# Altium schematic sheet Page13 SOM Interface.SchDoc
size 386 x 246 mm
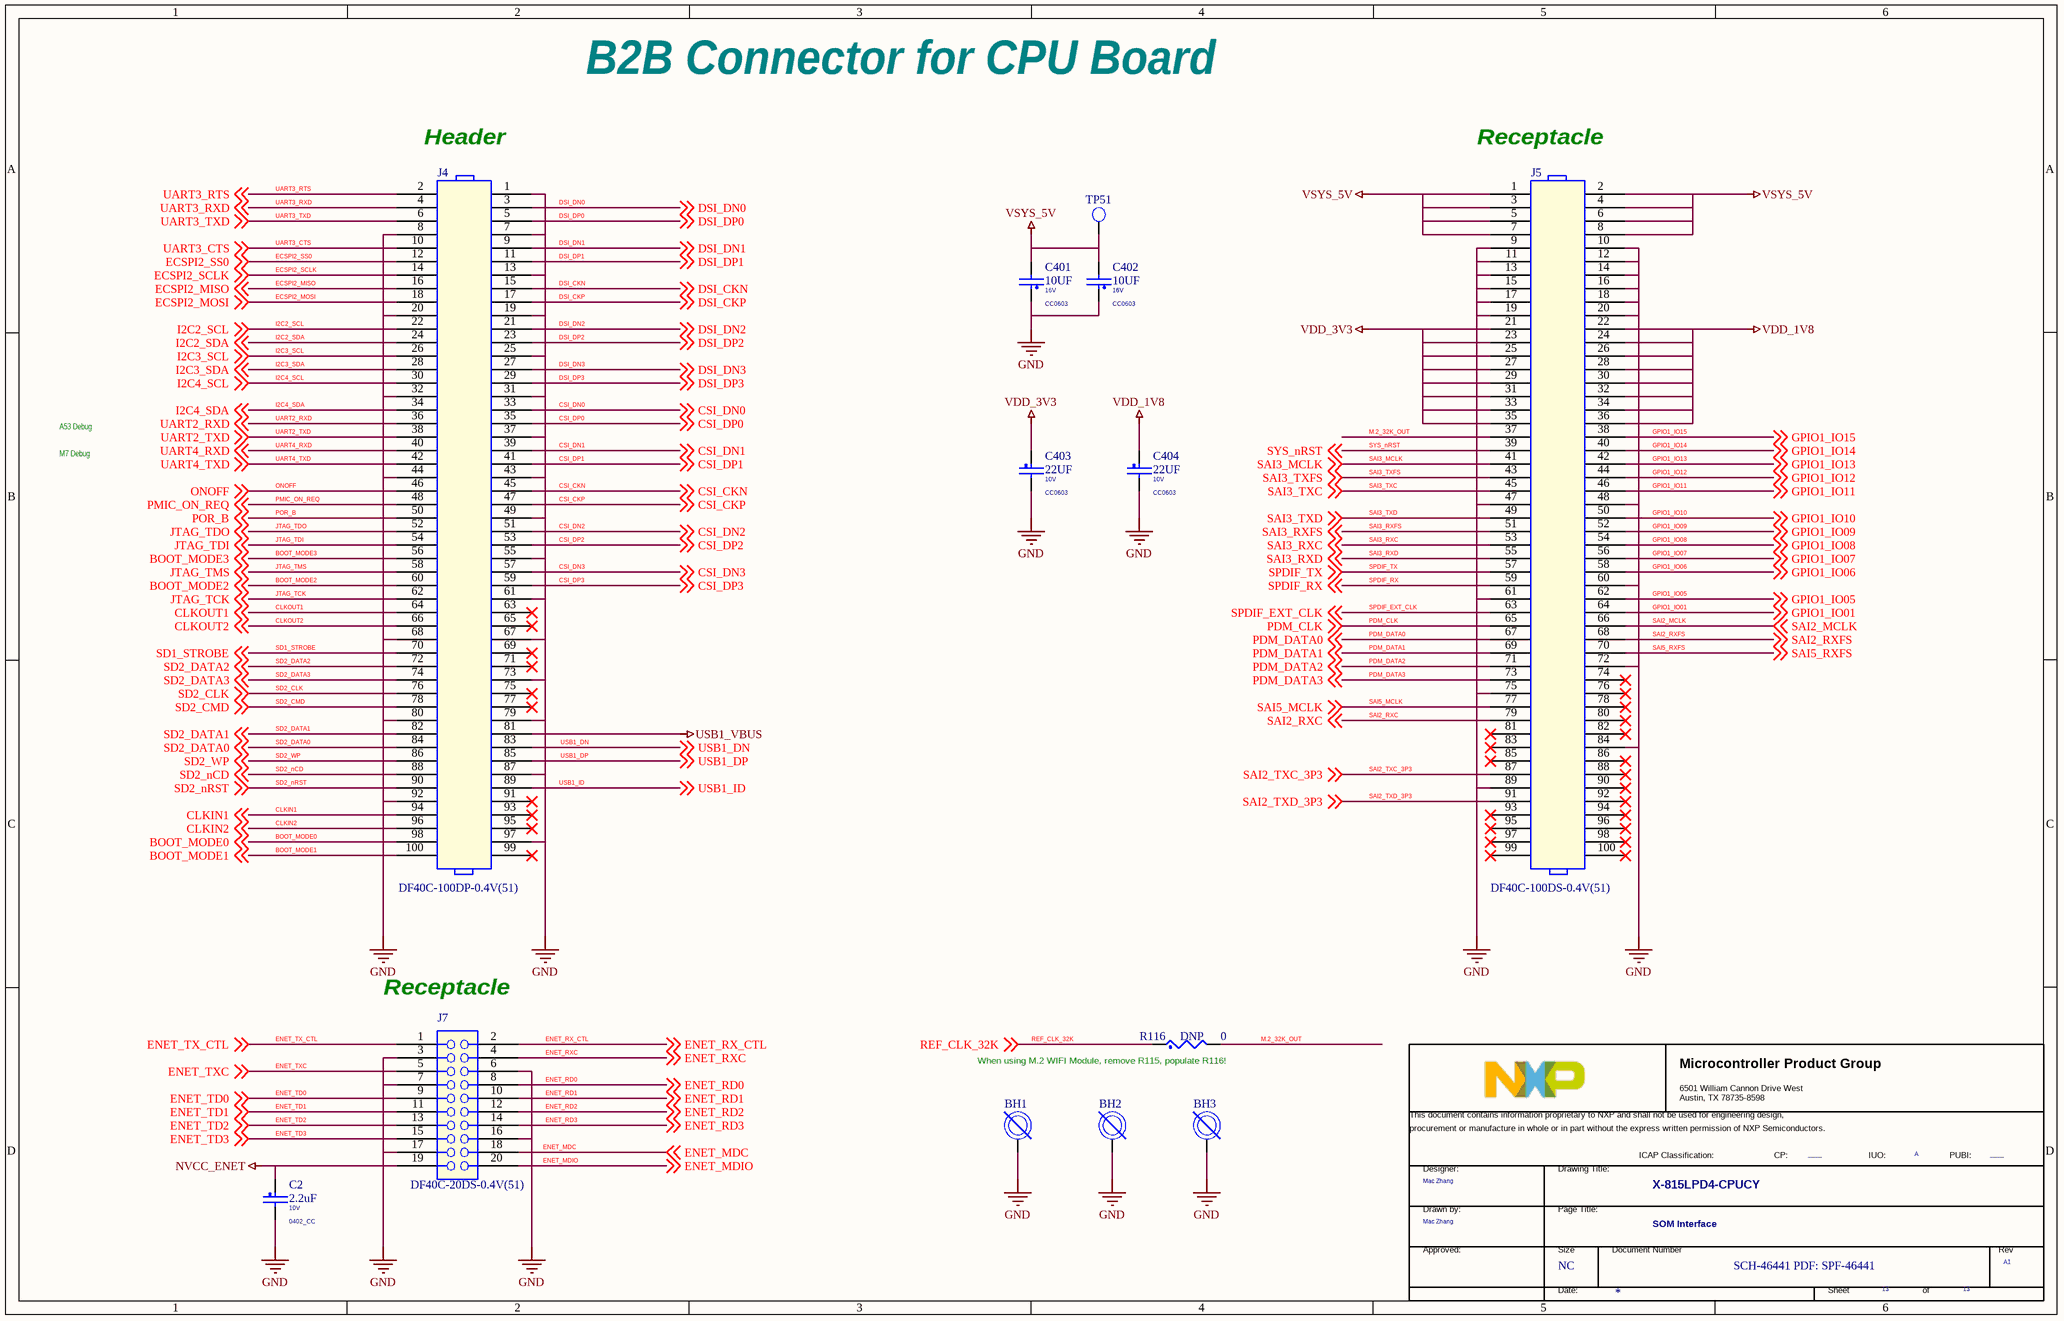
[diagram p0: Page13 SOM Interface.SchDoc]

## Parts
*  Doc: SCH-46441 PDF: SPF-46441  RevCode: A1  Title: X-815LPD4-CPUCY  Page Size: NC  Page Number: 13  PageTitle: SOM Interface  Designer: Mac Zhang  PUBI: ____  FIUO: A  (hidden comment: TitleBlock_MCPG)  (graphical)
BH1  MOUNTING HOLE  [GNDPOINT256]  (value not drawn)
BH2  MOUNTING HOLE  [GNDPOINT256]  (value not drawn)
BH3  MOUNTING HOLE  [GNDPOINT256]  (value not drawn)
C2  2.2uF  VOLTAGE: 10V  [0402_CC]
C401  10UF  VOLTAGE: 16V  [CC0603]
C402  10UF  VOLTAGE: 16V  [CC0603]
C403  22UF  VOLTAGE: 10V  [CC0603]
C404  22UF  VOLTAGE: 10V  [CC0603]
J4  DF40C-100DP-0.4V(51)  [con100_0p4_21p7x2p05_sm]
J5  DF40C-100DS-0.4V(51)  [con100_0p4_22p8x3p1_sm]
J7  DF40C-20DS-0.4V(51)  [con20_0p4_6p8x3p1_sm]
R116  0  ASSY_OPT: DNP  [0402_CC]
TP51  TP_35MIL  [testpoint_35mil]  (value not drawn)

## Nets
GND: BH1.1 BH2.1 BH3.1 C2.2 C401.1 C402.1 C403.2 C404.2 J4.1 J4.7 J4.8 J4.13 J4.19 J4.20 J4.25 J4.31 J4.32 J4.37 J4.43 J4.44 J4.49 J4.55 J4.61 J4.67 J4.68 J4.73 J4.79 J4.80 J4.87 J4.92 J4.97 J5.9 J5.10 J5.11 J5.12 J5.13 J5.14 J5.15 J5.16 J5.17 J5.18 J5.19 J5.20 J5.47 J5.48 J5.60 J5.61 J5.72 J5.75 J5.84 J5.89 J7.3 J7.6 J7.7 J7.16 J7.17
NVCC_ENET: C2.1 J7.19
USB1_VBUS: J4.81
VDD_1V8: C404.1 J5.22 J5.24 J5.26 J5.28 J5.30 J5.32 J5.34 J5.36
VDD_3V3: C403.1 J5.21 J5.23 J5.25 J5.27 J5.29 J5.31 J5.33 J5.35
VSYS_5V: C401.2 C402.2 J5.1 J5.2 J5.3 J5.4 J5.5 J5.6 J5.7 J5.8 TP51.1(TP)
BOOT_MODE0: J4.98 ; off-sheet BOOT_MODE0
BOOT_MODE1: J4.100 ; off-sheet BOOT_MODE1
BOOT_MODE2: J4.60 ; off-sheet BOOT_MODE2
BOOT_MODE3: J4.56 ; off-sheet BOOT_MODE3
CLKIN1: J4.94 ; off-sheet CLKIN1
CLKIN2: J4.96 ; off-sheet CLKIN2
CLKOUT1: J4.64 ; off-sheet CLKOUT1
CLKOUT2: J4.66 ; off-sheet CLKOUT2
CSI_CKN: J4.45 ; off-sheet CSI_CKN
CSI_CKP: J4.47 ; off-sheet CSI_CKP
CSI_DN0: J4.33 ; off-sheet CSI_DN0
CSI_DN1: J4.39 ; off-sheet CSI_DN1
CSI_DN2: J4.51 ; off-sheet CSI_DN2
CSI_DN3: J4.57 ; off-sheet CSI_DN3
CSI_DP0: J4.35 ; off-sheet CSI_DP0
CSI_DP1: J4.41 ; off-sheet CSI_DP1
CSI_DP2: J4.53 ; off-sheet CSI_DP2
CSI_DP3: J4.59 ; off-sheet CSI_DP3
DSI_CKN: J4.15 ; off-sheet DSI_CKN
DSI_CKP: J4.17 ; off-sheet DSI_CKP
DSI_DN0: J4.3 ; off-sheet DSI_DN0
DSI_DN1: J4.9 ; off-sheet DSI_DN1
DSI_DN2: J4.21 ; off-sheet DSI_DN2
DSI_DN3: J4.27 ; off-sheet DSI_DN3
DSI_DP0: J4.5 ; off-sheet DSI_DP0
DSI_DP1: J4.11 ; off-sheet DSI_DP1
DSI_DP2: J4.23 ; off-sheet DSI_DP2
DSI_DP3: J4.29 ; off-sheet DSI_DP3
ECSPI2_MISO: J4.16 ; off-sheet ECSPI2_MISO
ECSPI2_MOSI: J4.18 ; off-sheet ECSPI2_MOSI
ECSPI2_SCLK: J4.14 ; off-sheet ECSPI2_SCLK
ECSPI2_SS0: J4.12 ; off-sheet ECSPI2_SS0
ENET_MDC: J7.18 ; off-sheet ENET_MDC
ENET_MDIO: J7.20 ; off-sheet ENET_MDIO
ENET_RD0: J7.8 ; off-sheet ENET_RD0
ENET_RD1: J7.10 ; off-sheet ENET_RD1
ENET_RD2: J7.12 ; off-sheet ENET_RD2
ENET_RD3: J7.14 ; off-sheet ENET_RD3
ENET_RX_CTL: J7.2 ; off-sheet ENET_RX_CTL
ENET_RXC: J7.4 ; off-sheet ENET_RXC
ENET_TD0: J7.9 ; off-sheet ENET_TD0
ENET_TD1: J7.11 ; off-sheet ENET_TD1
ENET_TD2: J7.13 ; off-sheet ENET_TD2
ENET_TD3: J7.15 ; off-sheet ENET_TD3
ENET_TX_CTL: J7.1 ; off-sheet ENET_TX_CTL
ENET_TXC: J7.5 ; off-sheet ENET_TXC
GPIO1_IO01: J5.64 ; off-sheet GPIO1_IO01
GPIO1_IO05: J5.62 ; off-sheet GPIO1_IO05
GPIO1_IO06: J5.58 ; off-sheet GPIO1_IO06
GPIO1_IO07: J5.56 ; off-sheet GPIO1_IO07
GPIO1_IO08: J5.54 ; off-sheet GPIO1_IO08
GPIO1_IO09: J5.52 ; off-sheet GPIO1_IO09
GPIO1_IO10: J5.50 ; off-sheet GPIO1_IO10
GPIO1_IO11: J5.46 ; off-sheet GPIO1_IO11
GPIO1_IO12: J5.44 ; off-sheet GPIO1_IO12
GPIO1_IO13: J5.42 ; off-sheet GPIO1_IO13
GPIO1_IO14: J5.40 ; off-sheet GPIO1_IO14
GPIO1_IO15: J5.38 ; off-sheet GPIO1_IO15
I2C2_SCL: J4.22 ; off-sheet I2C2_SCL
I2C2_SDA: J4.24 ; off-sheet I2C2_SDA
I2C3_SCL: J4.26 ; off-sheet I2C3_SCL
I2C3_SDA: J4.28 ; off-sheet I2C3_SDA
I2C4_SCL: J4.30 ; off-sheet I2C4_SCL
I2C4_SDA: J4.34 ; off-sheet I2C4_SDA
JTAG_TCK: J4.62 ; off-sheet JTAG_TCK
JTAG_TDI: J4.54 ; off-sheet JTAG_TDI
JTAG_TDO: J4.52 ; off-sheet JTAG_TDO
JTAG_TMS: J4.58 ; off-sheet JTAG_TMS
M.2_32K_OUT: J5.37 R116.2
ONOFF: J4.46 ; off-sheet ONOFF
PDM_CLK: J5.65 ; off-sheet PDM_CLK
PDM_DATA0: J5.67 ; off-sheet PDM_DATA0
PDM_DATA1: J5.69 ; off-sheet PDM_DATA1
PDM_DATA2: J5.71 ; off-sheet PDM_DATA2
PDM_DATA3: J5.73 ; off-sheet PDM_DATA3
PMIC_ON_REQ: J4.48 ; off-sheet PMIC_ON_REQ
POR_B: J4.50 ; off-sheet POR_B
REF_CLK_32K: R116.1 ; off-sheet REF_CLK_32K
SAI2_MCLK: J5.66 ; off-sheet SAI2_MCLK
SAI2_RXC: J5.79 ; off-sheet SAI2_RXC
SAI2_RXFS: J5.68 ; off-sheet SAI2_RXFS
SAI2_TXC_3P3: J5.87 ; off-sheet SAI2_TXC_3P3
SAI2_TXD_3P3: J5.91 ; off-sheet SAI2_TXD_3P3
SAI3_MCLK: J5.41 ; off-sheet SAI3_MCLK
SAI3_RXC: J5.53 ; off-sheet SAI3_RXC
SAI3_RXD: J5.55 ; off-sheet SAI3_RXD
SAI3_RXFS: J5.51 ; off-sheet SAI3_RXFS
SAI3_TXC: J5.45 ; off-sheet SAI3_TXC
SAI3_TXD: J5.49 ; off-sheet SAI3_TXD
SAI3_TXFS: J5.43 ; off-sheet SAI3_TXFS
SAI5_MCLK: J5.77 ; off-sheet SAI5_MCLK
SAI5_RXFS: J5.70 ; off-sheet SAI5_RXFS
SD1_STROBE: J4.70 ; off-sheet SD1_STROBE
SD2_CLK: J4.76 ; off-sheet SD2_CLK
SD2_CMD: J4.78 ; off-sheet SD2_CMD
SD2_DATA0: J4.84 ; off-sheet SD2_DATA0
SD2_DATA1: J4.82 ; off-sheet SD2_DATA1
SD2_DATA2: J4.72 ; off-sheet SD2_DATA2
SD2_DATA3: J4.74 ; off-sheet SD2_DATA3
SD2_nCD: J4.88 ; off-sheet SD2_nCD
SD2_nRST: J4.90 ; off-sheet SD2_nRST
SD2_WP: J4.86 ; off-sheet SD2_WP
SPDIF_EXT_CLK: J5.63 ; off-sheet SPDIF_EXT_CLK
SPDIF_RX: J5.59 ; off-sheet SPDIF_RX
SPDIF_TX: J5.57 ; off-sheet SPDIF_TX
SYS_nRST: J5.39 ; off-sheet SYS_nRST
UART2_RXD: J4.36 ; off-sheet UART2_RXD
UART2_TXD: J4.38 ; off-sheet UART2_TXD
UART3_CTS: J4.10 ; off-sheet UART3_CTS
UART3_RTS: J4.2 ; off-sheet UART3_RTS
UART3_RXD: J4.4 ; off-sheet UART3_RXD
UART3_TXD: J4.6 ; off-sheet UART3_TXD
UART4_RXD: J4.40 ; off-sheet UART4_RXD
UART4_TXD: J4.42 ; off-sheet UART4_TXD
USB1_DN: J4.83 ; off-sheet USB1_DN
USB1_DP: J4.85 ; off-sheet USB1_DP
USB1_ID: J4.89 ; off-sheet USB1_ID

Not connected (* = marked no-connect by the designer): J4 63* 65* 69* 71* 75* 77* 91* 93* 95* 99*; J5 74* 76* 78* 80* 81* 82* 83* 85* 86* 88* 90* 92* 93* 94* 95* 96* 97* 98* 99* 100*

## Notes on the sheet
- B2B Connector for CPU Board
- (near J4) Header
- (near J5) Receptacle
- A53 Debug
- M7 Debug
- (near J7) Receptacle
- (near R116) When using M.2 WIFI Module, remove R115, populate R116!
- (in symbol TitleBlock_MCPG) Microcontroller Product Group; 6501 William Cannon Drive West / Austin, TX 78735-8598; This document contains information proprietary to NXP and shall not be used for engineering design,; procurement or manufacture in whole or in part without the express written permission of NXP Semiconductors.; ICAP Classification:; CP:; IUO:; PUBI:; Designer:; Drawing Title:; Drawn by:; Page Title:; Approved:; Size; Document Number; Rev; Date:; Sheet; of

## Library data of the parts
* = TitleBlock_MCPG: OrgAddr1: NO. 192 Liangjing Rd. Pudong New Area, ShangHai; OrgName: NXP Semiconductor; Page Create Date: March  8, 1995; Page Count: 13; DrawnBy: Mac Zhang; FCP: ____; Page Modify Date: *
BH1 = MOUNT_HOLE: MOUNTING HOLE DRILL 109 PAD 200 PLATED TH NO PART TO ORDER; CLASS: IC; CAD_APPROVED: Yes; ASSY_OPT: DNP; AGILE_PN: 280-75147; HEIGHT: 0.005 MILS; ROHS: Yes; PCB Footprint: GNDPOINT256
BH2 BH3 = MOUNT_HOLE: MOUNTING HOLE DRILL 109 PAD 200 PLATED TH NO PART TO ORDER; CLASS: IC; AGILE_PN: 280-75147; ASSY_OPT: DNP; CAD_APPROVED: Yes; ROHS: Yes; HEIGHT: 0.005 MILS; PCB Footprint: GNDPOINT256
C2 = CAP_NP: CAP CER 2.2uF 10V 10% X5R 0402; CLASS: DISCRETE; AGILE_PN: 150-78974; MFG_NAME01: TDK; MFG_PN01: C1005X5R1A225K; CAD_APPROVED: Yes; FPLIST: CC0402_25,CC0402_HD,0402_CC; Tolerance: 10%; ROHS: Yes; HEIGHT: 0.55 MM; PCB Footprint: 0402_CC; Package Size: 0402
C401 = CAP_NP: CAP CER 10.0uF 16V 10% X5R 0603; CLASS: DISCRETE; AGILE_PN: 150-80060; MFG_NAME01: MURATA; MFG_PN01: GRM188R61C106KAALD; Temp_Range: -55¡ãC to +85¡ãC; CAD_APPROVED: Yes; FPLIST: CC0603_OV,CC0603,0603_CC,cc0603_0805_nsp; Tolerance: 10%; ROHS: Yes; HEIGHT: 0.9MM; PCB Footprint: CC0603; Package Size: 0603; Package Type: SMT; Temp Range: -55¡ãC to +85¡ãC
C402 = CAP_NP: CAP CER 10.0uF 16V 10% X5R 0603; CLASS: DISCRETE; FPLIST: CC0603_OV,CC0603,0603_CC,cc0603_0805_nsp; CAD_APPROVED: Yes; Temp_Range: -55¡ãC to +85¡ãC; MFG_PN01: GRM188R61C106KAALD; MFG_NAME01: MURATA; AGILE_PN: 150-80060; HEIGHT: 0.9MM; ROHS: Yes; Tolerance: 10%; PCB Footprint: CC0603; Package Size: 0603; Package Type: SMT; Temp Range: -55¡ãC to +85¡ãC
C403 C404 = CAP_NP: CAP CER 22uF 10V 20% X5R 0603; CLASS: DISCRETE; WVDC: 6.3V; AGILE_PN: 150-79530; MFG_NAME01: TDK; MFG_PN01: C1608X5R1A226M080AC; CAD_APPROVED: Yes; FPLIST: CC0603_OV,CC0603,0603_CC; SIGNAL_MODEL: DEFAULT_CAPACITOR_2.2e+07pF_2_1; Tolerance: 20%; ROHS: Yes; HEIGHT: 1MM; PCB Footprint: CC0603; Package Size: 0603
J4 = HDR_2X50_M: CON 2X50 PLUG SHRD SMT 0.4MM SP 51H AU; CLASS: IO; CAD_APPROVED: Yes; Temp_Range: -35 to 85 &#8451;; MFG_NAME01: HIROSE; AGILE_PN: 211-80305; PCB Footprint: con100_0p4_21p7x2p05_sm; HEIGHT: 1.29MM; ROHS: Yes; MFG_PN01: DF40C-100DP-0.4V(51); Temp Range: -35 to 85 &#8451;
J5 = HDR_2X50_M: CON 2X50 SKT SHRD SMT 0.4MM SP 65H AU; CLASS: IO; AGILE_PN: 211-80183; MFG_NAME01: HIROSE; Temp_Range: -35C to +85C; CAD_APPROVED: Yes; MFG_PN01: DF40C-100DS-0.4V(51); ROHS: Yes; HEIGHT: 1.65 MM; PCB Footprint: con100_0p4_22p8x3p1_sm; Package Type: SMT; Temp Range: -35C to +85C
J7 = CONN_HDR_10X2: CON 2X10 SKT SHRD SMT 0.4MM SP 63H AU; CLASS: IO; CAD_APPROVED: Yes; Temp_Range: -35C to 85C; MFG_NAME01: HIROSE; AGILE_PN: 211-80328; PCB Footprint: con20_0p4_6p8x3p1_sm; HEIGHT: 1.6MM; ROHS: Yes; MFG_PN01: DF40C-20DS-0.4V(51); Temp Range: -35C to 85C
R116 = RES: RES MF ZERO OHM 1/16W 5% 0402; CLASS: DISCRETE; CAD_APPROVED: Yes; MFG_PN01: MCR01MZPJ000; MFG_NAME01: ROHM; AGILE_PN: 470-75394; VOLTAGE: 1/16W; HEIGHT: 0.45 MM; ROHS: Yes; Tolerance: 5%; PCB Footprint: 0402_CC
TP51 = T POINT R: TEST POINT PAD .035 SMT, no part to order; ASSY_OPT: DNP; CLASS: IC; CAD_APPROVED: Yes; AGILE_PN: 510-75618; HEIGHT: 0.1MM; ROHS: Yes; PCB Footprint: testpoint_35mil